# EAGLE board Lattepanda_shild_v1.3 (EAGLE 6.5.0)
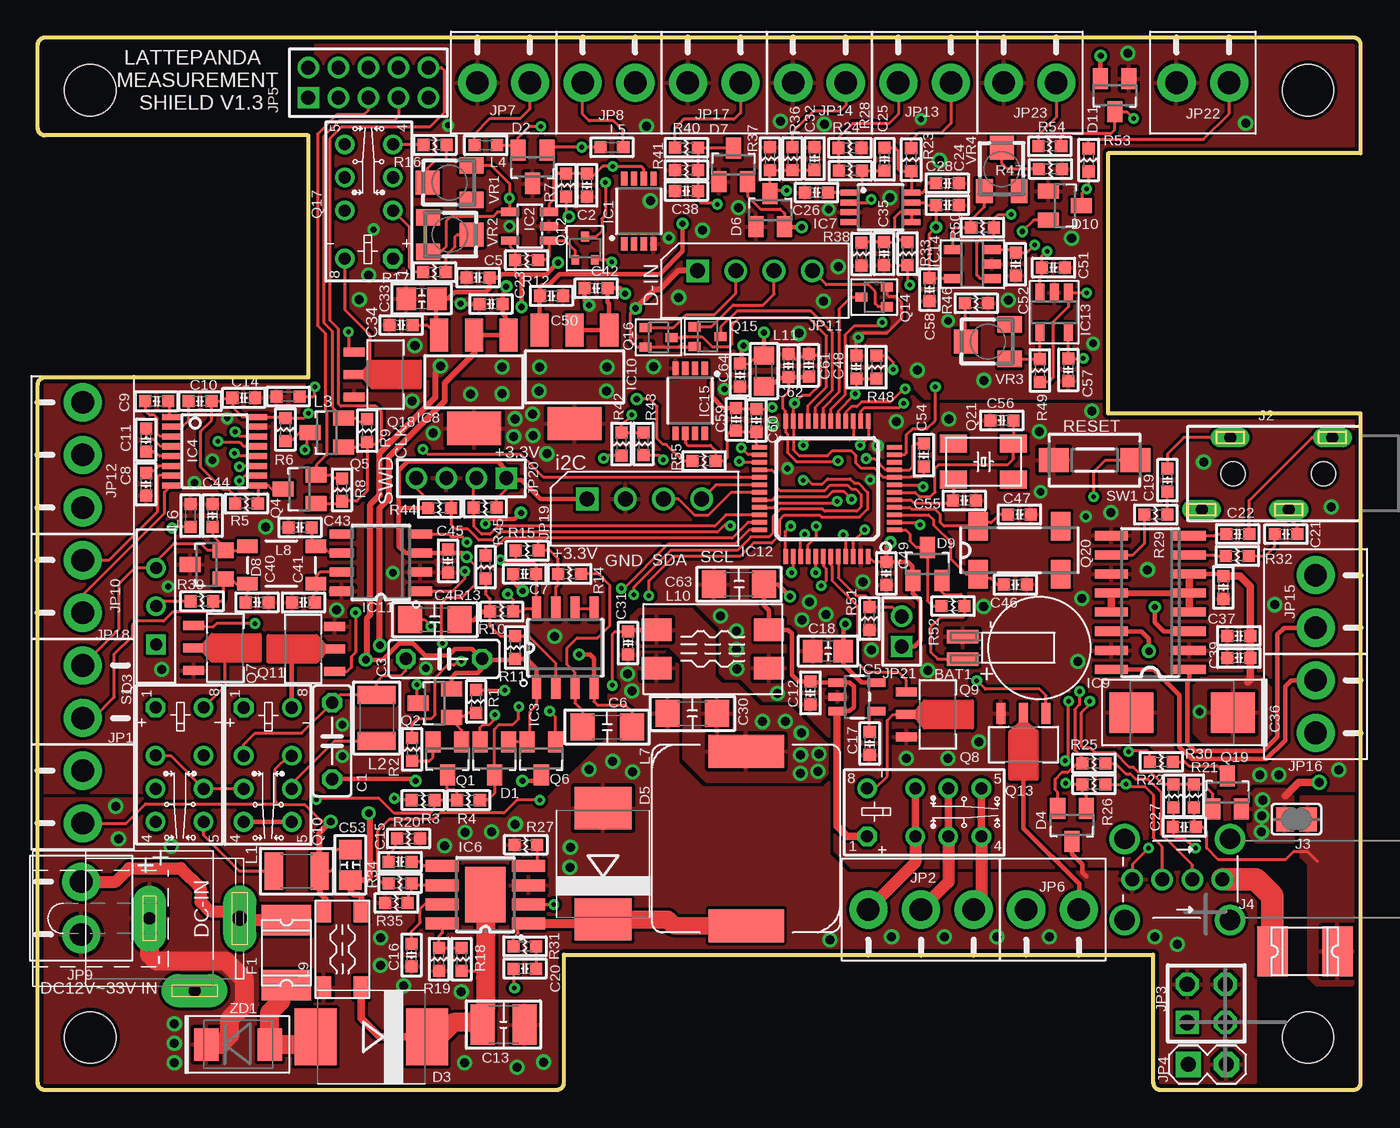
[diagram p2: board, top side]
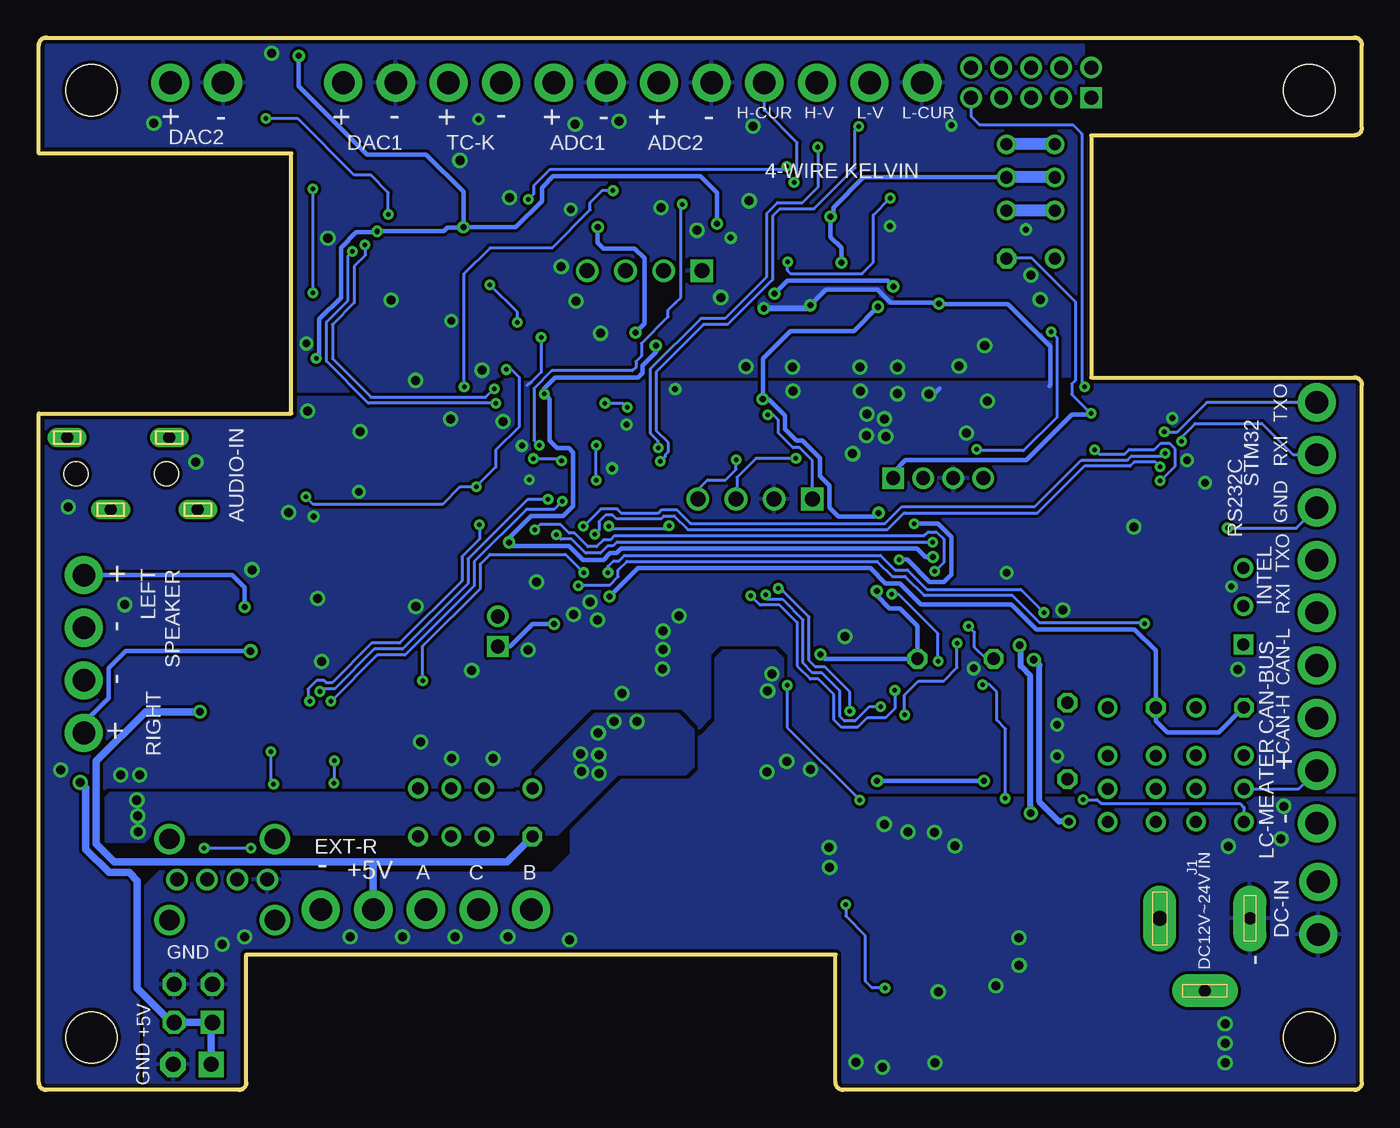
[diagram p3: board, bottom side, seen from below]

Size 88 x 70 mm. Coordinates in mm from the lower left corner, seen from the top.
Outline: 87.5,70 0.5,70 arc90 0,69.5 0,64 arc90 0.5,63.5 18,63.5 18,47.4 0.5,47.4 arc90 0,46.9 0,0.5 arc90 0.5,0 34.5,0 arc90 35,0.5 35,9 74.2,9 74.2,0.5 arc90 74.7,0 87.5,0 arc90 88,0.5 88,45 71.2,45 71.2,62.3 88,62.3 88,69.5 arc90 87.5,70
Copper layers (1*16): Top 0.035mm / dielectric 1.5mm / Bottom 0.035mm
Design rules "KHC_mm": minimum track width 0.2mm, minimum drill 0.3mm, track to track 0.2mm, track to pad 0.2mm, pad to pad 0.2mm, via to via 0.2mm, smd to smd 0.2mm, copper to edge 10mil, drill to drill 0.2mm, minimum pad ring 10mil, minimum via ring 8mil, stop-mask expansion 4mil, vias tented up to drill 0mil, thermal gap 10mil
Net classes: 0 default: width 0.178 mm, drill 0.3 mm, clearance 0.178 mm; 1 power: width 0.152 mm; 2 GND: width 0.152 mm, clearance 0.152 mm
Holes 3.4 mm at 3.5,66.5 84.5,66.5 3.5,3.5 84.5,3.5

## Footprints (pad centres in the part's own frame; a part is rotated, then mirrored left to right if it is on the bottom)
MS621 = smd 2.1 x 0.9: + 5.1,0.75; - 5.1,-0.75
C050-025X075 = drill 0.813 octagon: 1 -2.54,0; 2 2.54,0
C0603 = smd 0.8 x 0.8: 1 -0.762,0; 2 0.762,0
C3216 = smd 1.6 x 1.8: 1 -1.651,0; 2 1.651,0
C3225 = smd 1.6 x 2.7: 1 -1.397,0; 2 1.397,0
C2012 = smd 1.3 x 1.5: 1 -1.016,0; 2 1.016,0
C1608- = smd 0.8 x 0.8: 1 -0.762,0; 2 0.762,0
D/7343-31W = smd 2.95 x 2.7: + 3.375,0; - -3.375,0
SOT23 = smd 1 x 1.4: D 0,-1.1; G 0.95,1.1; S -0.95,1.1
SMC = smd 2.8 x 3.8: A 3.7,0; C -3.7,0
1812L = smd 2.03 x 3.3: P$1 -2.16,0; P$2 2.16,0
MS8 = smd 0.42 x 0.899: 1 -0.975,-2.166; 2 -0.325,-2.166; 3 0.325,-2.166; 4 0.975,-2.166; 5 0.975,2.166; 6 0.325,2.166; 7 -0.325,2.166; 8 -0.975,2.166
SOT23-5L = smd 0.55 x 1.2: 1 -0.95,-1.3; 2 0,-1.3; 3 0.95,-1.3; 4 0.95,1.3; 5 -0.95,1.3
SO8 = smd 0.6 x 1.6: 1 -1.905,-2.6; 2 -0.635,-2.6; 3 0.635,-2.6; 4 1.905,-2.6; 5 1.905,2.6; 6 0.635,2.6; 7 -0.635,2.6; 8 -1.905,2.6
PW_R-PDSO-G16 = smd 0.4 x 1.2: 1 -2.275,-2.9; 2 -1.625,-2.9; 3 -0.975,-2.9; 4 -0.325,-2.9; 5 0.325,-2.9; 6 0.975,-2.9; 7 1.625,-2.9; 8 2.275,-2.9; 9 2.275,2.9; 10 1.625,2.9; 11 0.975,2.9; 12 0.325,2.9; 13 -0.325,2.9; 14 -0.975,2.9; 15 -1.625,2.9; 16 -2.275,2.9
SOT23-5 = smd 0.55 x 1.2: 1 -0.95,-1.3; 2 0,-1.3; 3 0.95,-1.3; 4 0.95,1.3; 5 -0.95,1.3
S08-EP1 = smd 0.8 x 2.2: 1 -1.905,-2.87; 2 -0.635,-2.87; 3 0.635,-2.87; 4 1.905,-2.87; 5 1.905,2.87; 6 0.635,2.87; 7 -0.635,2.87; 8 -1.905,2.87 | smd 3.7 x 2.71: EX_PAD 0,0
MSOP8 = smd 0.4 x 1.2: 1 -0.975,-2.05; 2 -0.325,-2.05; 3 0.325,-2.05; 4 0.975,-2.05; 5 0.975,2.05; 6 0.325,2.05; 7 -0.325,2.05; 8 -0.975,2.05
SOT223-4 = smd 1.2 x 2.2: 1 -2.311,-3.1; 2 0,-3.1; 3 2.311,-3.1 | smd 3.6 x 2.2: 4 0,3.1
SOIC16N = smd 0.6 x 2.2: 1 -4.445,-2.6; 2 -3.175,-2.6; 3 -1.905,-2.6; 4 -0.635,-2.6; 5 0.635,-2.6; 6 1.905,-2.6; 7 3.175,-2.6; 8 4.445,-2.6; 9 4.445,2.6; 10 3.175,2.6; 11 1.905,2.6; 12 0.635,2.6; 13 -0.635,2.6; 14 -1.905,2.6; 15 -3.175,2.6; 16 -4.445,2.6
TQFP48 = smd 0.3 x 1: 1 -2.75,-4.5; 2 -2.25,-4.5; 3 -1.75,-4.5; 4 -1.25,-4.5; 5 -0.75,-4.5; 6 -0.25,-4.5; 7 0.25,-4.5; 8 0.75,-4.5; 9 1.25,-4.5; 10 1.75,-4.5; 11 2.25,-4.5; 12 2.75,-4.5; 25 2.75,4.5; 26 2.25,4.5; 27 1.75,4.5; 28 1.25,4.5; 29 0.75,4.5; 30 0.25,4.5; 31 -0.25,4.5; 32 -0.75,4.5; 33 -1.25,4.5; 34 -1.75,4.5; 35 -2.25,4.5; 36 -2.75,4.5 | smd 1 x 0.3: 13 4.5,-2.75; 14 4.5,-2.25; 15 4.5,-1.75; 16 4.5,-1.25; 17 4.5,-0.75; 18 4.5,-0.25; 19 4.5,0.25; 20 4.5,0.75; 21 4.5,1.25; 22 4.5,1.75; 23 4.5,2.25; 24 4.5,2.75; 37 -4.5,2.75; 38 -4.5,2.25; 39 -4.5,1.75; 40 -4.5,1.25; 41 -4.5,0.75; 42 -4.5,0.25; 43 -4.5,-0.25; 44 -4.5,-0.75; 45 -4.5,-1.25; 46 -4.5,-1.75; 47 -4.5,-2.25; 48 -4.5,-2.75
SOT23-5' = smd 0.6 x 1.2: 1 -0.95,-1.306; 2 0,-1.306; 3 0.95,-1.306; 4 0.95,1.306; 5 -0.95,1.306
SPC4077 = drill 0.8 pad 2.184 long: 1 -3,0; 2 0,-4.8 | drill 1 pad 2.184 long: 3 3,0
PJ-327-2 = drill 0.8 long: 1 -2.4,-1.9; 2 2.4,-4.8; 3 -2.4,-8.7; 4 2.4,-10.6 | hole 1.6: 0,-2.5; 0,-8.5
SJ = smd 1.168 x 1.6: 1 -0.762,0; 2 0.762,0
USB_AF_SIDE = drill 0.92: 1 3,0; 2 1,0; 3 -1,0; 4 -3,0 | drill 1.35: SH1 -3.5,2.7; SH2 3.5,2.7; SH3 -3.5,-2.7; SH4 3.5,-2.7
ED350V-02P = drill 1.5 pad 2.54: 1 -1.75,0; 2 1.75,0
ED350V-03P = drill 1.5 pad 2.54: 1 -3.5,0; 2 0,0; 3 3.5,0
2X02 = drill 1.016 square: 1 -1.27,-1.27 | drill 1.016 octagon: 2 -1.27,1.27; 3 1.27,-1.27; 4 1.27,1.27
MA02-1-MOL = drill 1 pad 1.676 square: 1 -1.27,0 | drill 1 pad 1.676 octagon: 2 1.27,0
2X05M = drill 0.914 square: 1 -4,-1 | drill 0.914: 2 -4,1; 3 -2,-1; 4 -2,1; 5 0,-1; 6 0,1; 7 2,-1; 8 2,1; 9 4,-1; 10 4,1
MOLEX5267-04 = drill 1 square: 1 -3.81,0 | drill 1: 2 -1.27,0; 3 1.27,0; 4 3.81,0
1X04M = drill 0.914 square: 1 -3,0 | drill 0.914: 2 -1,0; 3 1,0; 4 3,0
1X02M = drill 0.914 square: 1 -1,0 | drill 0.914: 2 1,0
L1210 = smd 1.2 x 2.5: 1 -1.524,0; 2 1.524,0
L0603 = smd 0.8 x 0.8: 1 -0.762,0; 2 0.762,0
SHP1260P-F = smd 2.2 x 5: 1 -5.8,0; 2 5.8,0
ACT45B = smd 1.35 x 0.9: 1 -2.275,1.25; 2 -2.275,-1.25; 3 2.275,-1.25; 4 2.275,1.25
SRF0602 = smd 1.5 x 1: 1 -2.55,1.25; 2 2.55,1.25; 3 2.55,-1.25; 4 -2.55,-1.25
SRF0905 = smd 2 x 1.5: 1 -3.75,1.27; 2 3.75,1.27; 3 3.75,-1.27; 4 -3.75,-1.27
L0805 = smd 1.2 x 1.3: 1 -1.016,0; 2 1.016,0
ANG200X = drill 0.8 octagon: 1 -4.3,-1.6 | drill 0.8: 2 -1.1,-1.6; 3 1.1,-1.6; 4 3.3,-1.6; 5 3.3,1.6; 6 1.1,1.6; 7 -1.1,1.6; 8 -4.3,1.6
MPT3 = smd 0.6 x 1.4: BASE -1.5,-2; EMITTER 1.5,-2 | smd 0.6 x 1.3: COLLECTOR 0,-2.05
SOT323 = smd 0.5 x 0.65: 1 0.65,-0.775; 2 -0.65,-0.775; 3 0,0.775
SC59-BEC = smd 0.6 x 0.8: 1 0.65,-0.863; 2 -0.65,-0.863; 3 0,0.863
MC-306 = smd 1.3 x 1.9: 1 -2.75,-1.6; 2 2.75,-1.6; 3 2.75,1.6; 4 -2.75,1.6
SMD5032 = smd 1.8 x 1.2: 1 -2,-1.2; 2 2,-1.2; 3 2,1.2; 4 -2,1.2
R0603 = smd 0.8 x 0.8: 1 -0.762,0; 2 0.762,0
R0603@1 = smd 0.8 x 0.8: 1 -0.762,0; 2 0.762,0
255SB = drill 0.8 square: 1 -2.54,0 | drill 0.8: 2 0,0; 3 2.54,0
DTSM-3 = smd 2 x 1.6: 1 -2.7,0; 2 2.7,0
R-TRIMMER-3313J = smd 1.1 x 1.6: 1 -1.15,-1.45; 3 1.15,-1.45 | smd 1.6 x 1.6: 2 0,1.45
SMB = smd 1.62 x 2.18: A 2.11,0; C -2.11,0

## Placement (x,y rotation side)
BAT1  MS621  [MS621]  66.63,29.41 180 top
C1  1000pF/1%  [C050-025X075]  19.59,23.22 270 top
C2  0.1uF  [C0603]  36.54,60.18 90 top
C3  1000pF  [C050-025X075]  27.03,28.68 0 top
C4  10uF/16V  [C3216]  26.42,31.29 180 top
C5  0.1uF  [C0603]  29.29,54.04 180 top
C6  10uF/16V  [C3216]  37.88,24.14 0 top
C7  0.1uF  [C0603]  32.39,34.33 180 top
C8  0.1uF  [C0603]  7.21,40.29 90 top
C9  0.1uF  [C0603]  7.92,45.81 0 top
C10  0.1uF  [C0603]  10.81,45.82 180 top
C11  0.1uF  [C0603]  7.21,43.23 90 top
C12  1uF/10V  [C0603]  51.4,26.41 90 top
C13  10uF/35V  [C3225]  30.99,4.35 0 top
C14  0.1uF  [C0603]  13.72,46.04 180 top
C15  2.2nF/50V  [C0603]  24.11,15.18 180 top
C16  0.1uF/50V  [C0603]  24.87,8.98 270 top
C17  470pF  [C0603]  55.34,23.05 90 top
C18  4.7uF  [C2012]  52.57,29.2 180 top
C19  0.22uF  [C0603]  75.14,40.57 90 top
C20  10nF/50V  [C0603]  32.41,8.07 180 top
C21  0.22uF  [C0603]  83.03,36.97 0 top
C22  1uF  [C0603]  79.82,36.98 0 top
C23  0.1uF/50V  [C1608-]  30.15,52.28 0 top
C24  1nF  [C0603]  60.5,60.31 0 top
C25  10nF  [C0603]  56.33,61.9 270 top
C26  1nF  [C0603]  51.81,59.69 180 top
C27  0.1uF  [C0603]  76.26,17.49 180 top
C28  0.1uF  [C0603]  60.51,58.86 0 top
C29  1uF  [C0603]  78.86,33.43 270 top
C30  22uF/10V  [C3216]  43.55,25.04 180 top
C31  0.1uF  [C0603]  39.27,29.73 270 top
C32  10nF  [C0603]  51.68,61.96 90 top
C33  4.7uF  [C2012]  25.54,52.63 180 top
C34  10nF  [C1608-]  24.18,50.88 0 top
C35  1uF  [C0603]  56.29,55.62 270 top
C36  470uF  [D/7343-31W]  76.12,25.11 0 top
C37  1uF  [C0603]  79.89,30.2 0 top
C38  10nF  [C0603]  43.15,59.79 180 top
C39  0.1uF  [C0603]  79.89,28.74 0 top
C40  47pF  [C0603]  14.59,32.44 0 top
C41  47pF  [C0603]  17.68,32.43 180 top
C42  0.1uF/50V  [C0603]  37.15,53.33 180 top
C43  47pF  [C0603]  17.45,37.42 180 top
C44  47pF  [C0603]  11.64,38.21 270 top
C45  0.1uF  [C0603]  27.29,35.19 90 top
C46  12.5pF  [C0603]  65.03,33.61 180 top
C47  12.5pF  [C0603]  65.3,38.28 180 top
C48  0.1uF  [C0603]  54.45,48.09 90 top
C49  1uF  [C0603]  56.45,34.36 270 top
C50  1uF/16V  [C0603]  34.18,52.82 180 top
C51  10nF  [C0603]  67.56,54.7 180 top
C52  10nF  [C0603]  65.06,54.93 90 top
C53  4.7uF  [C2012]  20.79,14.97 90 top
C54  1uF  [C0603]  58.94,42.23 90 top
C55  18pF  [C0603]  61.63,39.21 180 top
C56  18pF  [C0603]  64.13,44.54 0 top
C57  100nF  [C0603]  68.55,47.9 90 top
C58  100nF  [C0603]  59.32,53.24 90 top
C59  1uF  [C0603]  46.46,44.61 90 top
C60  10nF  [C0603]  47.8,44.54 270 top
C61  1uF  [C0603]  51.29,48.2 270 top
C62  10nF  [C0603]  49.93,48.18 270 top
C63  22uF/10V  [C3216]  46.65,33.64 180 top
C64  1uF  [C0603]  46.72,47.54 90 top
D1  BAV99  [SOT23]  30.38,22.05 0 top
D2  NUP2105  [SOT23]  32.92,61.4 0 top
D3  MBRS540T3  [SMC]  22.2,3.53 180 top
D4  NUP2105  [SOT23]  68.79,17.63 0 top
D5  MBRS540T3  [SMC]  37.61,15.05 90 top
D6  BAV99  [SOT23]  48.72,58.53 180 top
D7  BAV99  [SOT23]  46.27,61.53 180 top
D8  NUP2105  [SOT23]  11.24,34.95 270 top
D9  BAT54C  [SOT23]  59.18,34.98 180 top
D10  BAV99  [SOT23]  68.31,58.82 90 top
D11  BAV99  [SOT23]  71.64,66.16 0 top
F1  1812L110/33  [1812L]  16.55,9.13 90 top
F2  FSMD300R  [1812L]  84.28,9.22 0 top
IC1  LT1634ACS-1.25  [MS8]  39.99,58.45 0 top
IC2  LT6202  [SOT23-5L]  32.73,57.45 90 top
IC3  LM311  [SO8]  35.1,29.41 0 top
IC4  MAX3232CPW  [PW_R-PDSO-G16]  11.78,42.49 270 top
IC5  MIC5219-3.3V  [SOT23-5]  54.5,26.15 270 top
IC6  AOZ1284PI  [S08-EP1]  29.78,12.99 90 top
IC7  AD8495  [MSOP8]  56.06,58.71 270 top
IC8  TLE4266  [SOT223-4]  29.02,47.11 180 top
IC9  PAM8403  [SOIC16N]  74,32.42 90 top
IC10  TLE4266GSV10  [SOT223-4]  35.71,47.44 180 top
IC11  SN65HVD230  [SO8]  22.83,35.08 90 top
IC12  STM32F373X  [TQFP48]  52.5,40 90 top
IC13  LT1783  [SOT23-5']  67.61,51.73 180 top
IC14  LT1783  [SOT23-5']  62.17,54.93 90 top
IC15  LT1634ACS-2.5  [MS8]  43.4,45.85 180 top
J1  DC_POWER  [SPC4077]  10.44,11.41 0 top
J2  PJ-327  [PJ-327-2]  88.02,41 270 top
J3  B0  [SJ]  83.72,18.01 180 top
J4  USB A/F  [USB_AF_SIDE]  75.8,14 0 top
JP1  LC  [ED350V-02P]  3,19.49 270 top
JP2  RELAY1  [ED350V-03P]  58.75,12 0 top
JP3  Latte_5V  [2X02]  77.72,5.77 0 top
JP4  FAN  [MA02-1-MOL]  77.8,1.7 0 top
JP5  Latte_Intel  [2X05M]  22,67 0 top
JP6  LOW_SIDE_OUT  [ED350V-02P]  67.5,12 0 top
JP7  4WIR1  [ED350V-02P]  31,67 180 top
JP8  4WIR1  [ED350V-02P]  38,67 180 top
JP9  DC-IN  [ED350V-02P]  2.9,12.1 270 top
JP10  RS232C_LA  [ED350V-02P]  3,33.49 270 top
JP11  DI  [MOLEX5267-04]  47.71,54.49 0 top
JP12  RS232C_MCU  [ED350V-03P]  3,42.24 270 top
JP13  TC1  [ED350V-02P]  59,67 180 top
JP14  ADC1/COP1  [ED350V-02P]  52,67 180 top
JP15  L-SPEAKER  [ED350V-02P]  85,32.5 90 top
JP16  R-SPEAKER  [ED350V-02P]  85,25.5 90 top
JP17  ADC2/COP2  [ED350V-02P]  45,67 180 top
JP18  CAN-BUS  [ED350V-02P]  3,26.49 90 top
JP19  i2C  [MOLEX5267-04]  40.36,39.31 0 top
JP20  SWD  [1X04M]  28.18,40.7 180 top
JP21  BOOT  [1X02M]  57.46,30.5 90 top
JP22  DAC1  [ED350V-02P]  77.5,67 180 top
JP23  DAC1  [ED350V-02P]  66,67 180 top
L1  100uH/1812R-104F  [L1210]  17.24,14.55 0 top
L2  100uH/1812R-104F  [L1210]  22.55,24.74 90 top
L3  BEAD  [L0603]  16.67,46.13 180 top
L4  BEAD  [L0603]  29.81,62.84 180 top
L5  BEAD  [L0603]  38.19,62.7 0 top
L6  BEAD  [L0603]  10.17,38.21 90 top
L7  22uH  [SHP1260P-F]  47.12,16.73 270 top
L8  ACT45B-510-2P-TL003  [ACT45B]  16.23,34.92 180 top
L9  SRF0602-100Y  [SRF0602]  20.28,9.36 90 top
L10  SRF0905-100Y  [SRF0905]  44.9,29.34 0 top
L11  10uH  [L0805]  48.31,47.82 270 top
Q1  Si2333DS  [SOT23]  27.26,22.05 0 top
Q2  BSS138SOT23  [SOT23]  26.42,25.73 270 top
Q3  AGN2004  [ANG200X]  9.44,21.14 270 top
Q4  BSS138SOT23  [SOT23]  17.44,39.97 270 top
Q5  BSS138SOT23  [SOT23]  19.24,43.73 270 top
Q6  2N7002  [SOT23]  33.5,22.05 0 top
Q7  DTDG23YP  [MPT3]  12.39,29.41 270 top
Q8  AGN2004  [ANG200X]  59.47,18.46 0 top
Q9  DTDG23YP  [MPT3]  59.77,24.98 270 top
Q10  AGN2004  [ANG200X]  15.31,21.13 270 top
Q11  DTDG23YP  [MPT3]  17.75,29.34 90 top
Q12  2SB1694  [SOT323]  36.41,55.99 0 top
Q13  DTDG23YP  [MPT3]  65.57,23.06 180 top
Q14  DTC114EUA  [SC59-BEC]  55.64,52.74 90 top
Q15  DTC114EUA  [SC59-BEC]  44.55,50.11 270 top
Q16  DTC114EUA  [SC59-BEC]  41.3,50.06 270 top
Q17  AGN2003  [ANG200X]  22.03,59.6 90 top
Q18  DTDG23YP  [MPT3]  23.04,47.59 270 top
Q19  Si2333DS  [SOT23]  79.12,19.79 180 top
Q20  32.768k  [MC-306]  65.3,35.9 0 top
Q21  8MHz  [SMD5032]  62.91,41.79 0 top
R1  1k  [R0603]  29.17,25.84 270 top
R2  1k  [R0603]  24.9,22.66 90 top
R3  1kF  [R0603]  25.65,19.28 0 top
R4  10k  [R0603]  28.65,19.28 0 top
R5  10kF  [R0603]  13.89,39.01 180 top
R6  10kF  [R0603]  16.48,43.93 90 top
R7  18k  [R0603]  35.14,60.18 90 top
R8  10kF  [R0603]  20.25,39.92 270 top
R9  10kF  [R0603]  21.91,43.86 270 top
R10  100k  [R0603]  30.87,31.82 0 top
R11  100k  [R0603]  31.77,29.43 90 top
R12  100kF  [R0603]  32.53,55.2 180 top
R13  100k  [R0603]  29.79,34.78 90 top
R14  47k  [R0603]  35.38,34.32 180 top
R15  1k  [R0603]  32.56,35.87 180 top
R16  360  [R0603]  26.43,62.86 180 top
R17  3.6k  [R0603]  26.39,54.4 180 top
R18  47k  [R0603]  28.19,8.7 270 top
R19  11k  [R0603]  26.69,8.7 90 top
R20  10kF  [R0603]  24.66,16.73 180 top
R21  10k  [R0603]  76.9,19.57 270 top
R22  10k  [R0603]  75.55,19.56 90 top
R23  10kF  [R0603]  58.1,61.88 270 top
R24  1M  [R0603]  54.03,62.66 180 top
R25  27  [R0603]  70.26,21.73 0 top
R26  27  [R0603]  70.26,20.34 0 top
R27  46.6k  [R0603]  32.47,16.31 180 top
R28  10kF  [R0603]  54.05,61.14 0 top
R29  1k  [R0603]  74.36,38.28 180 top
R30  1.5k  [R0603]  74.75,21.83 0 top
R31  0  [R0603]  32.41,9.56 180 top
R32  1k  [R0603]  79.79,35.52 180 top
R33  30kF  [R0603]  57.86,55.63 270 top
R34  52.3kF  [R0603]  24.11,13.75 180 top
R35  10kF  [R0603]  23.86,12.45 0 top
R36  115kF  [R0603]  50.2,61.95 270 top
R37  10kF  [R0603]  48.71,61.94 270 top
R38  10kF  [R0603]  54.8,55.6 90 top
R39  120  [R0603@1]  10.93,32.51 180 top
R40  115kF  [R0603]  43.15,62.67 0 top
R41  10kF  [R0603]  43.15,61.18 0 top
R42  2.2k  [R0603]  38.83,42.97 270 top
R43  2.2k  [R0603]  40.29,42.98 270 top
R44  10k  [R0603]  26.73,38.72 180 top
R45  10k  [R0603]  29.77,38.74 0 top
R46  53kF  [R0603]  62.43,52.33 180 top
R47  53kF  [R0603]  67.37,61.26 180 top
R48  10k  [R0603]  55.79,48.08 270 top
R49  30kF  [R0603]  66.66,47.86 270 top
R50  30kF  [R0603]  62.85,57.36 0 top
R51  10k  [R0603]  55.33,31.36 90 top
R52  11k  [R0603]  60.88,32.19 0 top
R53  100  [R0603]  69.9,61.86 90 top
R54  100  [R0603]  67.31,62.77 180 top
R55  18k  [R0603]  44.33,41.84 0 top
S1  CAN_TERMI  [255SB]  7.88,32.18 90 top
SW1  RESET\  [DTSM-3]  70.3,41.89 180 top
VR1  50  [R-TRIMMER-3313J]  27.4,60.35 90 top
VR2  500  [R-TRIMMER-3313J]  27.42,56.9 270 top
VR3  10k  [R-TRIMMER-3313J]  63.2,49.78 90 top
VR4  10k  [R-TRIMMER-3313J]  64.12,61.24 0 top
ZD1  SM6T39CAY  [SMB]  13.33,3.03 0 top

## Tracks (layer width: path | path; a pad name or v marks a point on that pad's centre or on a via)
+1.25V_REF  (via drill 0.3)
  Top 0.2: IC2.3 34.03,58.91 34.33,59.21 34.33,60.77 34.5,60.94 R7.2 C2.2 36.61,60.87 36.61,60.84 36.99,60.84 37.59,61.44 v38.27,61.44 40.16,61.44 40.31,61.28 IC1.6 | IC7.2 55.23,59.03 v55.43,59.24
  Bottom 0.2: v55.43,59.24 55.08,59.59 55.08,60.14 53.98,61.23 38.47,61.23 v38.27,61.44
+3V3  (via drill 0.3, 0.4)
  Top 0.2: 27.29,35.72 C45.2 | 57.82,34.26 D9.G | IC12.17 53.25,45.15 54.31,46.21 v54.38,46.29 54.45,46.46 C48.1 R48.2 | C64.2 47.3,48.29 47.59,48.58 48.05,48.58 L11.1 48.42,48.99 | D7.S 47.22,59.45 48.08,58.59 49.39,58.59 49.67,58.31 D6.S | 55.5,35.25 IC12.48 55.63,35.12 C49.1 | R43.1 40.39,43.73 R42.1 38.85,43.75 38.85,44.22 v39.53,44.9 | R45.2 30.53,39.3 31.17,39.94 JP20.1 | R5.2 13.13,39.54 12.72,39.95 12.33,39.95 10.86,41.42 10.86,43.82 11.57,44.53 C10.1 12.22,45.82 12.4,46 12.92,46 C14.2 12.96,45.43 13.62,44.77 IC4.16 16.41,44.77 R6.2 17.71,44.69 v18.02,45 | v28.53,35.45 29.07,34.91 29.07,33.59 28.21,32.73 27.2,32.73 26.84,32.37 26.84,29.79 v26.92,29.71 | D1.S 29.43,24.13 29.63,24.33 30.07,24.33 30.42,24.68 v30.42,24.95
  Top 0.3: D6.S 49.71,57.39 v50.82,57.39 | v46.96,49.51 v46.96,49.5 46.8,49.34 46.8,48.32 C64.2 | 56.5,36.2 v56.73,36.43 56.45,36.15 C49.1 57.88,35.12 58.18,34.82 58.18,33.93 D9.G 58.23,33.01 58.72,32.52 58.72,29.91 58.3,29.49 JP21.1 | JP19.1 33.45,39.31 32.19,40.57 31.31,40.57 JP20.1 31.17,41.23 30.61,41.79 24.6,41.79 24.01,41.2 24.01,38.5 | 24.01,38.5 24.01,36.16 24.46,35.71 IC11.3 27.29,35.72 28.27,35.72 v28.53,35.45 | L11.1 v48.31,50.37 v48.32,50.38 | R44.2 24.23,38.72 24.01,38.5 | IC5.5 54.78,27.1 53.59,28.29 C18.1 | C18.1 | C18.1 53.59,30.86 v53.72,30.99
  Bottom 0.2: JP19.1 36.55,41.88 37.4,42.73 37.83,42.73 R42.1 38.83,44.59 39.14,44.9 v39.53,44.9 | Q17.1 23.61,55.32 21.94,55.32 19.06,52.44 19.06,47.19 19.29,46.96 19.29,46.27 v18.02,45 | v30.42,24.95 30.42,26.27 29.49,27.2 27.81,27.2 26.92,28.09 v26.92,29.71
  Bottom 0.3: v46.96,49.51 46.96,49.08 47.84,48.2 47.84,47.7 48.16,47.38 53.67,47.38 54.38,46.67 v54.38,46.29 54.04,45.95 54.04,43.19 53.54,42.69 52.73,42.69 52.45,42.41 52.45,38.85 53.13,38.17 55.27,38.17 56.73,36.71 v56.73,36.43 56.48,36.18 52.73,36.18 51.81,35.26 50.45,35.26 50,35.71 49.57,35.71 49.27,36.01 29.59,36.01 29.04,35.46 v28.54,35.46 v28.53,35.45 | v18.02,45 18.09,44.93 19.29,44.93 22.33,41.89 30.36,41.89 31.17,41.08 JP20.1 | JP21.1 56.64,29.51 55.16,30.99 v53.72,30.99 | v48.32,50.38 47.72,50.98 47.72,55.32 48.37,55.97 50.44,55.97 50.82,56.35 v50.82,57.39
+5V  (via drill 0.3, 0.6)
  Top 0.2: v33.39,19.29 31.89,19.29 31.02,18.42 26.76,18.42 26.33,17.99 23.39,17.99 22.63,17.23 22.63,14.05 22.93,13.75 R34.2 | 38.98,30.5 C31.1 39.16,30.49 38.39,30.49 38.23,30.33 v38.23,26.91
  Top 0.3: L10.1 39.09,30.61 C31.1
  Top 0.5: v85.25,20.46 83.87,20.46 82.97,19.56
  Bottom 0.2: v33.39,19.29 38.23,24.13 v38.23,26.91
  Bottom 0.5: JP4.1 76.53,4.42 JP3.1 JP3.3 79.19,4.5 81.45,6.76 81.45,13.91 82,14.46 83.32,14.46 84.88,16.02 84.88,20.09 v85.25,20.46
  other vias: 81.4,17.16 81.47,19.28 81.42,18.22 50.79,23.76 50.75,22.28 50.74,21.07 49.73,24.52 51.97,22.36 51.91,21.2 48.2,24.5
  pour Top: 83,20 81,20 80.5,19.5 80.5,17 81,16.5 83.5,16.5 83.5,19.5
  pour Bottom: 83.5,19.5 83.25,19.75 56.25,19.75 51,25 45.5,25 44.5,24 44.5,21.5 45,21 49.5,21 53.5,17 80.5,17 81,16.5 83.5,16.5
  pour Top: 40,32 43.5,32 45,30.5 45,27.5 45.5,27 46.5,27 48,25.5 50,25.5 52.5,23 52.5,21 52,20.5 44.5,20.5 43,22 43,28.5 42,29.5 40,29.5 39.5,30 39.5,31.5
+5V/1  (via drill 0.3, 0.4)
  Top 0.2: R7.1 35.14,58.28 v35.33,58.09 | IC2.5 31.43,56.1 31.77,55.76 R12.2 31.77,54.26 31.79,54.24 | C34.2 25.86,50.88 IC8.3 | 31.96,35.12 32.99,35.12 33.15,34.96 C7.1 33.2,34.29 IC3.8 32.39,32.01 32.2,31.82 R10.2 31.63,32.62 v31.26,32.99 | 31.96,35.12 30.93,35.12 v30.78,35.27 | R15.2 31.8,35.28 31.96,35.12 | R55.1 42.91,41.84 41.8,42.94 41.59,42.94 41.21,43.32 41.21,45.47 40.72,45.96 v39.86,45.96 v39.85,45.95 | R2.2 24.9,24.38 25.23,24.71 26.19,24.71 26.44,24.96 26.44,27.42 27.28,28.26 27.7,28.26 27.96,28.52 v28.19,28.52
  Top 0.3: 31.79,54.24 32.16,54.24 | 32.16,54.24 33.83,54.24 v34.62,55.03 | IC8.3 26.49,50.48 26.49,52.56 C33.1 27.31,52.63 27.75,53.07 29.81,53.07 30.05,53.31 C5.1 30.66,54.04 30.88,54.26 31.77,54.26 | v32.19,52.09 32.19,54.21 32.16,54.24 | v29.77,37.67 30.04,37.97 31.72,37.97 v32.14,38.39
  Bottom 0.2: v31.26,32.99 30.83,32.99 28.19,30.35 v28.19,28.52
  Bottom 0.3: v32.19,52.09 33.79,50.49 38.02,50.49 39.85,48.66 v39.85,45.95 39.46,45.95 38.38,44.87 38.38,43.95 37.62,43.19 37.2,43.19 36.05,42.04 36.05,40.84 35.41,40.2 35.41,38.73 34.81,38.13 32.4,38.13 v32.14,38.39 | v34.62,55.03 34.62,56.03 35.33,56.74 v35.33,58.09 35.14,58.28 35.14,58.7 33.14,60.7 Q17.3 | v29.77,37.67 28.19,37.67 27.3,36.78 27.3,34.29 27.8,33.79 28.75,33.79 30.23,35.27 v30.78,35.27
  Bottom 0.8: Q17.6 Q17.3
+5V/3  (via drill 0.4, 0.5)
  Top 0.2: 78.85,34.08 C29.1
  Top 0.3: IC9.6 78.73,34.33 C29.1 | IC5.3 54.01,25.2 54.28,25.47 54.28,26.83 54.01,27.1 IC5.1 51.47,27.1 C12.2 50.59,27.17 50.16,27.6 50.16,30.36 49.91,30.61 L10.2 48.65,31.89 48.31,32.23 C63.1 | C63.1 | C63.1 49.23,33.63 v50.03,32.83
  Top 0.4: IC9.12 IC9.5
  Top 0.5: 80.49,27.14 80.65,27.3 C39.2 C37.2 80.65,33.48 79.94,34.19 C29.1 | IC9.4 IC9.5 IC9.6 | IC9.13 IC9.12 | Q8.1 53.85,16.86 53.15,17.56 53.15,25.15 IC5.3
  Bottom 0.3: Q3.1 7.88,25.44 9.53,23.79 12.94,23.79 13.71,24.56 Q10.1 13.71,29.23 15.12,30.64 21.64,30.64 23.31,32.31 29.33,32.31 30.72,33.7 31.69,33.7 32.7,34.71 48.15,34.71 v50.03,32.83
  Bottom 0.5: v77.27,25.16 80.89,25.16 84.17,21.88 84.17,16.37 83.09,15.29 83.08,15.29 82.98,15.19 66,15.19 | 66,15.19 56.84,15.19 Q8.1 | 66,15.19 65.91,15.09 65.75,14.94 JP6.1
  pour Top: 77.5,27.5 81.29,27.5 81.99,26.8 81.99,23.64 81.31,22.96 77.69,22.96 76.89,23.76 76.89,26.89
+10V  (via drill 0.3, 0.34, 0.4)
  Top 0.2: IC7.7 58.98,59.03 59.16,58.86 C28.1 | 59.73,58.84 59.73,57.42 v59.76,57.39 59.32,56.95 C58.2 59.25,53.98 IC14.5 | IC13.5 C57.2 v69.55,48.66 | D10.S 66.26,57.87 v65.5,57.11
  Top 0.3: 59.73,58.84 C28.1 | D11.S v70.69,68.77 v70.7,68.78 | 33.26,52.64 C50.2 | 33.38,52.78 C50.2 | IC10.3 33.4,52.8 C50.2 | C50.2 33.41,53.4 33.55,53.54 33.98,53.54 34.72,54.28 41.38,54.28 42.9,55.8 v42.9,57.63
  Bottom 0.2: 59.78,57.37 v59.76,57.39 | 65.55,57.06 v65.5,57.11
  Bottom 0.3: v70.7,68.78 70.7,66.75 66.17,62.22 62.23,62.22 59.75,59.74 v59.75,57.4 v59.76,57.39 56.28,57.39 54.54,59.13 54.54,60.01 53.78,60.77 43.98,60.77 42.9,59.69 v42.9,57.63 | 59.78,57.37 60.83,57.37 61.09,57.11 v65.5,57.11 | 65.55,57.06 66.88,57.06 67.9,56.04 67.9,52.71 69.34,51.27 69.34,48.87 v69.55,48.66
+UB
  Top 0.2: 85.12,15.21 84.45,15.88 83.55,15.88 82.99,15.32 78.52,15.32 77.75,16.09 77.75,17.21 77.47,17.49 C27.1 76.9,17.41 R21.2
  pour Top (rank 3): 84,19.5 84,15.5 84.5,15 84.5,7.5 85,7 87.5,7 87.5,19.5
AGND  (via drill 0.3, 0.4, 0.5, 0.6)
  Top 0.2: 46.52,45.39 C59.2 46.53,45.3 C60.1 48.76,45.3 v48.86,45.4 v48.85,45.39 | C54.1 58.94,40.92 58.81,40.79 58.08,40.79 58.06,40.77 58.05,40.77 58.03,40.75 IC12.8 56.27,40.75 55.68,41.34 54.79,41.34 54.43,41.7 54.43,42.2 54.11,42.52 52.86,42.52 52.54,42.2 50.64,42.2 50.26,42.58 IC12.23 50.25,45.48 50.34,45.57 v50.34,45.69 50.87,46.22 51.35,46.22 52.06,46.93 52.06,48.74 51.95,48.85 51.4,48.85 C61.1 51.28,48.79 50.72,48.79 50.5,48.57 C62.1 | JP1.2 5.88,17.74 7.18,19.04 15.98,19.04 | C53.2 19.98,16.01 19.7,15.73 19.7,14.74 19.51,14.55 L1.2 | v19.49,17.86 18.89,17.86 17.8,18.95 16.07,18.95 15.98,19.04 | D1.G Q6.S 32.73,23.26 32.73,25.14 33.2,25.61 IC3.1 | 29.64,28.61 C3.2 | Q10.7 16.69,22.23 15.77,21.31 15.77,19.25 15.98,19.04 | IC3.4 37.01,25.84 37.23,25.61 39.08,25.61 39.52,25.17 C6.2
  Top 0.3: C59.2 45.6,45.37 44.85,46.13 44.85,47.11 | C3.2 | v21.82,28.63 21.85,28.6 22.95,28.6 24.04,29.69 24.97,29.69 25.76,28.9 27.34,28.9 27.78,29.34 28.91,29.34 C3.2 | C7.2 31.63,33.83 v32.27,33.19 | 29.64,28.61 31.71,28.61 R11.1 32.53,28.67 33.2,28 IC3.1 | IC3.4 37.01,28.7 36.75,28.96 v36,28.96 | Q2.S 27.52,27.41 27.84,27.73 29.26,27.73 29.57,28.04 C3.2
  Top 0.4: L9.2 19.17,12.69 18.78,13.08 18.78,14.53 L1.2 | 18.78,14.57 L1.2 | L1.2 18.76,17.13 v19.49,17.86 | v26.79,48.16 26.47,47.68 26.47,46.08 22.75,42.36 22.75,39.56 22.13,38.94 22.13,31.6 21.89,31.36 21.89,28.7 v21.82,28.63
  Bottom 0.2: 48.88,45.4 v48.86,45.4 49.15,45.69 v50.34,45.69
  Bottom 0.3: v36,28.96 35.72,28.68 C3.2 29.57,30.88 30.73,32.04 31.42,32.04 32.27,32.89 v32.27,33.19
  Bottom 0.4: v19.49,17.86 20.14,17.86 21.45,19.17 21.45,28.26 v21.82,28.63
  other vias: 33.38,48.09 30.88,48.09 37.88,48.09 56.68,59.35 53.25,54.77 59.99,61.83 68.77,56.66 60.55,51.17 64.56,52.53 72.52,68.95 52.61,58.58 46.62,58.69 42.64,52.72 22.02,54.2 31.39,57.47 22.35,57.24 27.31,64.16 40.51,64.11 49.4,64.43 58.75,64.58 52.32,64.23 58.51,47.87 62.94,47.2 80.34,64.3 44.22,57.18 25.09,49.51 40.96,48.12 21.4,52.56 41.98,56.68 40.75,59.14 52.27,52.48 50.64,50.33 70.2,49.65
  pour Top (rank 2): 18.5,70 88,70 88,62.5 71,62.5 71,46 59,46 57.5,47.5 18.5,47.5
  pour Bottom (rank 2): 18.5,70 88,70 88,62.5 71,62.5 71,46.5 58.5,46.5 57.5,47.5 18.5,47.5
BOOT1
  Top 0.2: IC12.44 53.25,34.07 54.45,32.87 55.07,32.87 55.35,32.59 R51.2 56.84,32.12 JP21.2
C_ADC  (via drill 0.3)
  Top 0.2: R4.2 29.93,19.28 30.38,19.73 D1.D 30.38,23.99 30.69,24.3 31.61,24.3 32,24.69 v32,25.49 | IC12.28 48.83,41.25 49.13,40.95 49.13,40.12 49.37,39.88 52.35,39.88 52.7,40.23 53.86,40.23 54.13,39.96 54.42,39.96 54.79,39.59 54.79,38.82 54.48,38.51 52.35,38.51 52.21,38.65 49.41,38.65 49.05,38.29 49.04,38.29 48.92,38.17 48.92,37.06 48.65,36.79 47.44,36.79 46.54,35.89 42.1,35.89 39.66,33.45 v39.66,32.93
  Bottom 0.2: v32,25.49 32.78,25.49 33.73,24.54 34.4,24.54 34.72,24.86 34.72,26.55 35.92,27.75 36.53,27.75 37.17,28.39 37.17,31.28 38.54,32.65 39.55,32.65 39.66,32.76 v39.66,32.93
C_CTL  (via drill 0.3)
  Top 0.2: IC12.15 54.25,43.49 54.02,43.26 51.31,43.26 v50.92,42.87 | v40.66,32.88 40.66,33.87 42.28,35.49 46.71,35.49 47.6,36.38 48.82,36.38 48.83,36.39 48.83,36.4 49.33,36.9 49.33,37.92 49.65,38.24 52.02,38.24 52.16,38.1 54.66,38.1 55.2,38.64 55.2,39.75 54.59,40.36 54.32,40.36 54.03,40.65 52.54,40.65 52.19,40.3 51.51,40.3 51.26,40.55 v50.92,40.55 | R1.1 31.04,26.6 v31.06,26.58
  Bottom 0.2: v40.66,32.88 40.03,32.25 38.72,32.25 37.57,31.1 37.57,28.22 36.69,27.34 36.16,27.34 35.12,26.3 35.12,24.63 34.61,24.12 33.55,24.12 33.52,24.15 33.51,24.15 32.88,24.78 31.66,24.78 31.06,25.38 v31.06,26.58 | v50.92,40.55 v50.92,42.87
CAN_RX  (via drill 0.3)
  Top 0.2: IC12.45 53.75,36.75 v53.57,36.93 | IC11.4 27.32,36.98 27.5,36.81 28.25,36.81 v28.54,36.44
  Bottom 0.2: v28.54,36.44 28.64,36.46 49.54,36.46 49.81,36.19 50.17,36.19 50.65,35.71 51.62,35.71 52.55,36.64 53.28,36.64 v53.57,36.93
CAN_TX  (via drill 0.3)
  Top 0.2: 25.52,33.08 IC11.1 27.59,33.17 28.41,33.99 v28.41,34.5 | IC12.46 54.25,36.5 v55.01,37.26
  Bottom 0.2: v28.41,34.5 27.81,35.1 27.81,36.64 28.3,37.13 28.84,37.13 29.1,36.87 49.7,36.87 49.98,36.59 50.44,36.59 50.89,36.14 51.48,36.14 52.38,37.04 52.73,37.04 53.3,37.61 54.66,37.61 v55.01,37.26
CANH
  Top 0.2: C40.1 13.79,32.24 13.79,32.79 13.98,32.98 L8.4 13.91,33.6 13.26,33.6 12.86,34 D8.G 12.34,32.63 12.22,32.51 R39.1 11.69,31.94 11.53,31.78 8.97,31.78 8.38,31.19 6.57,31.19 6.3,30.92 6.3,30.18 5.11,28.99 5.11,26.13 3.72,24.74 JP18.1
CANL
  Top 0.2: D8.S 13.84,35.9 L8.3 | JP18.2 5.4,30.64 5.4,33.67 6.45,34.72 S1.3 7.88,35.16 9.07,36.35 10.85,36.35 11.29,35.91 D8.S | D8.S 12.34,36.19 11.64,36.89 C44.2
COMP1_P  (via drill 0.3)
  Top 0.2: C32.1 51.67,61.19 R36.2 50.19,61.18 R37.2 48.72,61.17 D6.D 48.91,59.82 v49.81,59.82 | IC12.11 57.66,42.25 57.8,42.39 57.8,43.58 58.21,43.99 59.16,43.99 59.71,44.54 v59.71,46.77
  Bottom 0.2: v59.71,46.77 v59.7,46.78 59.7,54.3 58,56 53.86,56 51.32,58.54 51.32,59.03 50.53,59.82 v49.81,59.82
COMP2_P  (via drill 0.3)
  Top 0.2: D7.D 46.23,62.67 R40.2 R41.2 C38.1 43.91,59.23 44.12,59.02 45.1,59.02 v45.2,58.92 | IC12.13 55.25,43.4 v54.72,42.87
  Bottom 0.2: 54.92,43.07 v54.72,42.87 | 55.01,43.16 v54.72,42.87 | v54.72,42.87 55.06,43.21 55.06,46.67 53.89,47.84 48.53,47.84 48.29,48.08 48.29,48.45 47.92,48.82 47.92,49.66 46.14,51.44 46.14,51.88 45.66,52.36 45.65,52.36 45.3,52.71 45.3,58.82 v45.2,58.92
D+  (via drill 0.3)
  Top 0.2: R30.1 73.99,22.37 73.79,22.57 72.63,22.57 v72.57,22.51 | R26.2 v72.37,20.34 v72.38,20.35 | v72.38,20.35 72.44,20.35 | J4.3 74.8,16.18 74.2,16.78 74.2,19.63 73.66,20.17 72.56,20.17 v72.38,20.35
  Bottom 0.2: v72.57,22.51 72.57,20.54 v72.38,20.35
D-
  Top 0.2: R25.2 71.69,21.73 72.39,21.03 72.67,21.03 73.03,20.67 73.85,20.67 74.73,19.79 74.73,17.03 76.8,14.96 J4.2
DAC1_OUT1  (via drill 0.3)
  Top 0.2: IC12.14 54.75,45.15 54.98,45.38 57.31,45.38 v57.61,45.68 | IC13.3 66.66,53.96 66.8,54.1 C51.2 66.77,54.73 66.77,55.47 67.09,55.79 v67.14,55.79
  Bottom 0.2: v67.14,55.79 67.44,55.49 67.44,52.52 68.87,51.09 68.87,48.47 66.08,45.68 v57.61,45.68
DAC2_OUT1  (via drill 0.3)
  Top 0.2: IC12.16 53.75,45.08 54.12,45.45 54.48,45.45 54.82,45.79 56.75,45.79 57.61,46.65 v57.7,46.65 57.64,46.65 | IC14.3 64.99,55.88 C52.2 65.79,55.69 v66.3,56.2
  Bottom 0.2: v66.3,56.2 66.3,55.51 67.02,54.79 67.02,52.36 68.46,50.92 68.46,48.64 65.9,46.08 58.27,46.08 v57.7,46.65
DC-IN
  Top 1.27: F1.P$1 16.19,6.61 16.19,5.92 15.44,5.17 ZD1.A 18,3.03 D3.A
DI_CH1
  Top 0.2: IC12.19 52.25,45.37 53.29,46.41 53.29,51.93 54.1,52.74 Q14.3
DI_CH2
  Top 0.2: IC12.20 51.75,45.44 52.88,46.57 52.88,50.35 51.43,51.8 46.5,51.8 45.43,50.73 45.43,50.13 Q15.3
DI_CH3
  Top 0.2: IC12.21 51.25,45.54 52.48,46.77 52.48,50.15 51.27,51.36 46.68,51.36 46.19,50.87 46.19,49.64 46,49.45 44.84,49.45 44.18,50.11 42.97,50.11 42.92,50.06 Q16.3
GND  (via drill 0.3, 0.4, 0.5, 0.6)
  Top 0.2: 45.89,46.84 v45.67,46.62 | Q14.1 56.53,53.36 56.53,52.86 56.63,52.76 57.09,52.76 57.47,52.38 57.47,51.35 56.44,50.32 54.84,50.32 v54.59,50.07 54.45,49.93 C48.2 | Q15.1 43.64,49.41 Q16.1 39.83,49.41 39.45,49.79 39.45,51.66 v39.78,51.99
  Top 0.3: 36.5,53.56 C42.2 36.39,52.49 v36.69,52.19 | C23.1 28.15,52.28 v28.13,52.3
  Top 0.4: JP11.1 42.63,54.49 41.38,53.24 41.03,53.24 v39.78,51.99
  Bottom 0.2: v54.59,50.07 54.59,47.75 55.38,46.96 55.45,46.96 55.55,46.86
  Bottom 0.3: 28.11,46.64 28.56,46.19 | v36.69,52.19 35.64,53.24 32.23,53.24 31.36,52.37 28.2,52.37 v28.13,52.3 28.11,52.28 23.55,52.28 20.73,49.46 20.73,46.89 20.79,46.83
  Bottom 0.4: v39.78,51.99 36.89,51.99 v36.69,52.19
  other vias: 10.43,40.39 86.55,21.28 54.88,33.8 66.62,43.79 31.75,44.64 60.62,44.62 24.9,45.83 57.12,44.46 48.9,44.25 69.44,32.69 69.72,38.15 66.72,39.79 62.61,23.16 57.79,22.06 59.2,27.91 55.45,29.26 52.43,31.64 51.34,32.45 60.55,22.05 8.67,33.48 12.61,44.68 15.16,37.46 23.62,34.41 19.9,31.94 34.38,30.17 45.42,31.53 8.25,27.98 49.87,41.35 26.3,43.7 31.67,43.47 33.87,42.32 30.89,46.31 28.8,46.28 37.85,46.48 33.36,46.48 32.92,44.96 32.96,43.54 82.28,32.28 71.37,38.41 73.82,34.6 11.63,41.88 62.92,32.17 69.19,28.51 82.54,20.95 81.28,20.97 49.21,26.38 46.48,29.3 46.52,28.01 46.49,30.52 50.83,31.27 55.87,42.85 55.38,40.6 25.81,28.04 20.27,22.2 20.27,24.29 70.12,45.17 86.05,38.78 77.55,41.78
  pour Bottom (rank 4): 0,70 88,70 88,62.3 71.2,62.3 71.2,45 88,45 88,0 74.2,0 74.2,9 35,9 35,0 0,0 0,47.4 18,47.4 18,63.5 0,63.5
  pour Top (rank 4): 0,70 88,70 88,62.3 71.2,62.3 71.2,45 88,45 88,0 74.2,0 74.2,9 35,9 35,0 0,0 0,47.4 18,47.4 18,63.5 0,63.5
GNDINT  (via drill 0.3, 0.6)
  Top 0.2: v77,16.09 76.15,16.8 76.14,16.81 75.62,16.81 75.55,16.88 75.55,17.54 | J4.4 72.82,14.02 72.82,15.02 v73.88,16.08 | R22.1 75.55,17.54 | 75.55,17.54 C27.2
  Top 0.3: D4.D 68.79,15.71 69.5,15 69.5,14.47 69.75,14.22
  Top 1.27: J1.1 7.44,9.01 7.89,8.56 12.52,8.56 12.58,8.5 12.6,8.5 13.75,7.35 13.75,5.68 12.79,4.72 12.79,3.64 12.18,3.03 ZD1.C
  Bottom 0.2: v73.88,16.08 v76.99,16.08 v77,16.09
  other vias: 33.66,1.86 31.89,1.52 28.4,1.8 9.1,1.8 9.1,4.4 28.18,6.53 24.35,6.92 39.56,21.15 36.67,21.32 38.25,21.85 75.8,9.7 9.1,3.1 35.4,14.81 35.43,16.13 31.77,17.68 30.19,17.17 27.06,16.25 52.7,10 39.52,26.55 5.38,16.7 8.89,16.22 5.2,18.88 74.3,10.2 63.8,10.2 60.3,10.2 67.3,10.2 56.8,10.2 39.24,27.68 22.8,8.3 22.82,10.11 28.43,17.14
  pour Bottom (rank 3): 0,19.4 33.75,19.4 38.5,24 38.5,28.7 39,29.2 42.5,29.2 43,28.7 43,24.5 44,23.5 44.5,23.5 52.6,23.6 52.6,15.7 53.9,14.4 68.7,14.4 69.1,14.5 80,14.5 81,13.5 81,0.5 80.2,0 74.5,0 74.2,0.3 74.2,8.9 74.1,9 35.1,9 35,8.9 35,0.3 34.7,0 0.3,0 0,0.3
  pour Top (rank 3): 0,19.4 33.87,19.4 38,23.5 38,28.7 38.5,29.2 42.5,29.2 43,28.7 43,25 44,24 52.6,24.1 52.6,15.7 53.9,14.4 68.7,14.4 69.1,14.5 80,14.5 81,13.5 81,0.5 80.2,0 74.5,0 74.2,0.3 74.2,8.9 74.1,9 35.1,9 35,8.9 35,0.3 34.7,0 0.3,0 0,0.3
KELVIN_M  (via drill 0.3)
  Top 0.2: IC12.27 46.72,41.75 v46.66,41.81 | D2.S 31.97,63.35 32.71,64.09 v33.46,64.09 | 31.83,62.64 D2.S | 31.67,62.8 D2.S | L4.1 31.63,62.84 D2.S
  Bottom 0.2: v46.66,41.81 46.34,42.13 46.34,42.24 46.13,42.45 46.13,43.06 46.91,43.84 46.91,47.8 43.79,50.92 42.18,50.92 39.2,53.9 39.2,58.13 38.71,58.62 36.43,58.62 33.71,61.34 33.71,63.84 v33.46,64.09
KELVIN_P  (via drill 0.3)
  Top 0.2: IC12.26 47.26,42.25 v46.8,42.71 | L5.1 v36.2,62.7 v36.19,62.71 34.08,62.71 D2.G
  Bottom 0.2: v46.8,42.71 46.8,43.16 47.31,43.67 47.31,47.97 43.96,51.32 42.35,51.32 39.6,54.07 39.6,58.3 38.87,59.03 37.2,59.03 36.19,60.04 v36.19,62.71
L1  (via drill 0.3)
  Top 0.2: IC12.42 52.25,34.87 52.42,34.7 52.42,33.84 v52.11,33.53 | v14.45,31.03 11.9,31.03 11.67,30.8 Q7.BASE | Q7.BASE 10.03,30.69 9.88,30.84 10.28,30.84 Q7.BASE
  Bottom 0.2: v14.45,31.03 14.52,31.1 21.46,31.1 21.46,31.11 23.23,32.88 29.1,32.88 30.38,34.16 31.24,34.16 32.24,35.16 48.88,35.16 49.46,34.58 49.46,34.14 50.02,33.58 52.06,33.58 v52.11,33.53
L2  (via drill 0.3)
  Top 0.2: IC12.38 50.25,34.56 v50.14,34.42 | v21.15,31.76 21.15,29.11 20.86,28.82 20.86,28.1 20.6,27.84 Q11.BASE
  Bottom 0.2: v50.14,34.42 50.14,34.83 49.77,35.2 49.41,35.2 49.05,35.56 32.02,35.56 31.05,34.59 30.21,34.59 28.92,33.3 22.69,33.3 v21.15,31.76
L3  (via drill 0.3)
  Top 0.2: IC12.36 47.32,37.25 46.37,36.3 41.94,36.3 39,33.36 v38.81,33.36 | Q6.G 34.45,24.8 v34.05,25.2
  Bottom 0.2: v34.05,25.2 34.05,26.47 35.75,28.17 36.37,28.17 36.77,28.57 36.77,31.47 38.66,33.36 v38.81,33.36
LC_PULSE
  Top 0.2: IC12.35 47.24,37.75 46.2,36.71 33.5,36.71 | 33.5,36.71 31.08,36.71 30.53,36.16 29.88,36.16 29.79,36.07 R13.2 | R15.1 34.08,35.87 34.62,35.33 R14.2 34.62,33.62 34.47,33.47 IC3.7 | 33.19,35.87 R15.1 | R15.1 33.32,36.53 33.5,36.71
LEFT
  Top 0.2: C21.2 83.79,37.49 83.22,38.06 J2.2
N$1
  Top 0.3: JP6.2 69.27,12.02 69.27,13.7 65.57,17.4 Q13.COLLECTOR
N$2  (via drill 0.3)
  Top 0.2: L6.1 9.02,37.45 v8.95,37.38
  Bottom 0.2: v8.95,37.38 4.36,37.38 JP12.3
N$3
  Top 0.2: IC6.6 24.96,13.62 R34.1 24.84,13.21 24.63,13 R35.2
N$4  (via drill 0.3)
  Top 0.2: C20.2 31.65,6.86 v31.72,6.79 | IC6.2 34.31,12.36 v34.33,12.34
  Bottom 0.2: v34.33,12.34 34.33,11.58 33.02,10.27 33.02,7.23 32.58,6.79 v31.72,6.79
N$5
  Top 0.2: IC11.6 19.43,35.72 19.15,36 18.57,36 L8.2 18.21,36.35 C43.1
N$6
  Top 0.2: IC11.7 18.8,34.45 18.55,34.19 18.55,33.56 L8.1 18.52,33.05 18.3,32.83 18.3,32.25 C41.1
N$7
  Top 0.2: R17.1 27.16,55.49 27.76,56.09 27.76,56.76 27.9,56.9 VR2.2
N$8
  Top 0.2: R31.1 C20.1
N$9
  Top 0.2: R31.2 31.64,10.13 31.96,10.45 31.96,10.96 32.06,11.06 32.62,11.06 IC6.1
  Top 0.6: IC6.1 36.2,11.09 D5.C 36.46,11.34
  Top 1.2: 36.46,11.34 41.9,11.34 42.28,10.96 L7.2
N$10
  Top 0.2: IC6.5 25.68,14.89 25.39,15.18 C15.1
N$11
  Top 0.2: C15.2 23.35,15.67 23.82,16.14 23.82,16.64 R20.2
N$12
  Top 0.2: R39.2 8.21,32.51 S1.2
N$13
  Top 0.2: R47.2 64.49,61.26 64.12,61.63 VR4.2
N$14
  Top 0.2: IC4.5 8.1,42.16 7.8,42.47 C11.1
N$15
  Top 0.2: IC4.4 8.17,42.81 7.73,43.26 7.37,43.26 7.21,43.42 C11.2
N$16
  Top 0.2: IC4.2 9.62,44.12 10.05,44.54 C10.2
N$17
  Top 0.2: VR4.1 62.97,58.74 62.09,57.86 R50.1 61.02,57.36 60.86,57.2 IC14.4
N$18  (via drill 0.3)
  Top 0.2: R54.1 68.07,63.43 68.28,63.64 71.4,63.64 71.64,63.88 D11.D 72.46,65.06 v72.9,64.62 | v64.76,58.24 64.74,58.22 63.88,58.22 63.61,57.95 R50.2 63.61,56.74 63.5,56.63 62.75,56.63 62.46,56.34 62.46,54.2 62.68,53.98 IC14.1
  Bottom 0.2: v64.76,58.24 64.76,59.7 65.91,60.85 67.01,60.85 70.75,64.59 72.87,64.59 v72.9,64.62
N$19
  Top 0.2: IC6.8 26.91,10.45 26.69,10.23 R19.2 R18.1
N$20
  Top 0.2: JP7.1 32.76,65.28 32.11,64.63 30.11,64.63 29.05,63.57 L4.2
N$21
  Top 0.2: R27.1 33.23,15.02 33.3,14.95 32.7,14.95 IC6.4
N$22
  Top 0.2: JP8.2 36.23,66.98 36.23,64.92 36.69,64.46 38.29,64.46 38.95,63.8 L5.2
N$24
  Top 0.2: IC6.7 25.75,12.36 25.45,12.06 25.45,11.12 24.87,10.54 C16.1
N$25
  Top 0.2: IC12.1 57.75,37.25 58.01,36.99 58.01,36.53 58.46,36.08 D9.D 59.18,32.53 59.52,32.19 R52.1
N$26
  Top 0.2: IC4.6 8.06,41.52 7.72,41.17 7.33,41.17 C8.2 7.25,41.09
N$27
  Top 0.2: IC4.1 8.79,44.85 8.79,45.7 C9.2
N$28
  Top 0.2: IC4.8 8.45,39.78 8.45,38.37 3,32.92 JP10.2
N$29
  Top 0.2: IC4.3 8.16,43.47 7.97,43.66 7.97,44.69 7.77,44.89 7.46,44.89 7.16,45.19 C9.1
N$30
  Top 0.2: Q12.2 35.76,55.84 35.1,56.5 IC2.1 34.03,55.44 33.81,55.22 33.31,55.22 R12.1
N$31
  Top 0.2: Q8.8 55.7,20.06 56.51,20.87 56.51,24.59 56.9,24.98 Q9.COLLECTOR
N$32
  Top 0.2: IC4.7 8.06,40.87 7.98,40.78 7.98,38.47 4.75,35.24 JP10.1
N$33  (via drill 0.3)
  Top 0.2: L3.1 18.34,46.13 18.43,46.22 v18.43,46.78
  Bottom 0.2: JP5.9 26,64.76 25.43,64.19 19.22,64.19 18.63,63.6 18.63,46.98 v18.43,46.78
N$34  (via drill 0.3)
  Top 0.2: IC12.7 58.79,40.25 v58.91,40.13 | R48.1 56.45,48.84 56.91,48.38 v56.91,47.92 | SW1.1 71,41.89 70.24,41.13 v70.24,39.45
  Bottom 0.2: v56.91,47.92 56.56,47.92 56.05,47.41 56.05,44.11 57.61,42.55 57.61,41.43 v58.91,40.13 59.97,40.13 61.15,38.95 69.74,38.95 v70.24,39.45
N$35
  Top 0.2: C56.2 64.89,43.01 Q21.3 64.91,41.98 64.53,41.6 59.94,41.6 59.68,41.34 59.68,39.77 59.37,39.46 58.64,39.46 58.35,39.75 IC12.6
N$36  (via drill 0.3)
  Top 0.2: IC4.13 13.7,42.81 13.47,43.05 12.09,43.05 v12,43.14
  Bottom 0.2: JP12.2 4.58,42.24 6.67,44.33 11.08,44.33 12,43.41 v12,43.14
N$37
  Top 0.2: IC3.5 IC3.6
N$38  (via drill 0.3)
  Top 0.2: 58.96,42.94 C54.2 58.35,42.99 58.21,42.85 58.21,41.46 58,41.25 IC12.9 56.39,41.25 55.64,42 v55.1,42 | IC12.24 | 48.64,46.76 L11.2 | IC12.24 49.75,45.15 49.57,45.33 49.57,46.05 49.93,46.41 C62.2 | 48.61,46.79 L11.2 | 48.55,47.05 L11.2 | 51.26,47.25 C61.2 | IC12.24 49.75,43.75 49.86,43.64 49.86,42.41 50.47,41.8 53.17,41.8 v53.23,41.86
  Top 0.3: 48.55,47.05 49.06,47.05 49.37,47.36 49.87,47.36 C62.2 51.27,47.42 C61.2
  Bottom 0.2: v55.1,42 53.37,42 v53.23,41.86
N$39
  Top 0.2: R14.1 36.15,34.31 37.33,34.31 38.07,33.57 38.07,30.9 37.24,30.07 35.88,30.07 35.22,29.41 35.22,28.29 35.73,27.77 IC3.3 35.73,25.73 36.23,25.24 C6.1
N$40  (via drill 0.3)
  Top 0.2: IC4.14 13.45,43.47 v13.14,43.77
  Bottom 0.2: v13.14,43.77 12.29,43.77 10.32,45.74 JP12.1
N$41
  Top 0.2: C25.2 R28.2 54.81,59.83 54.67,59.69 IC7.1 | IC7.1 | IC7.1 C26.1
N$42
  Top 0.2: C25.1 57.06,62.66 57.23,62.49 57.23,61.25 57.36,61.12 R23.2 IC7.8 58.87,59.69 59.06,59.88 59.06,60.15 59.22,60.31 C24.1
N$43
  Top 0.2: IC9.7 78.37,35.59 78.44,35.52 R32.2
N$44
  Top 0.3: IC9.1 76.6,27.26 76.45,27.11 76.45,23.06 76.97,22.54 81.51,22.54 82.46,23.49 82.46,30.3 82.9,30.74 JP15.1
N$45
  Top 0.2: R28.1 53.29,62.64 R24.2 53.27,63.33 54.22,64.28 56.61,64.28 57.25,64.92 JP13.2
N$46
  Top 0.2: R23.1 58.1,63.16 58.57,63.63 60.08,63.63 60.75,64.3 JP13.1
N$47
  Top 0.2: 57.88,56.41 R33.1 57.7,56.55 57.31,56.55 56.98,56.88 56.98,58.02 57.34,58.39 IC7.6 IC7.5
N$48
  Top 0.2: IC3.2 34.46,28.39 32.66,30.19 R11.2 30.76,30.19 30.09,30.86 30.09,31.8 R10.1 | 30.09,32.05 R10.1 | R13.1 29.79,32.99 30.11,32.67 R10.1
  Top 0.3: C4.1 28.99,31.22 29.59,31.82 R10.1
N$49  (via drill 0.3)
  Top 0.2: Q12.3 37.16,56.77 37.53,57.14 37.53,57.94 37.77,58.18 v37.77,60.36
  Bottom 0.2: 39.75,65.16 39.75,65.2 | 39.75,65.2 JP8.1 | v37.77,60.36 37.77,60.56 37.56,60.77 37.56,63.01 39.75,65.2
N$50
  Top 0.2: R36.1 50.2,63.7 51.61,65.11 53.36,65.11 53.75,65.5 JP14.1
N$51
  Top 0.2: R40.1 42.39,63.98 42.69,64.28 42.97,64.56 46.31,64.56 46.75,65 JP17.1
N$52  (via drill 0.4)
  Top 0.3: IC9.3 74.89,30.52 74.31,31.1 v74.31,32.12
  Bottom 0.3: JP15.2 75.15,34.25 74.31,33.41 v74.31,32.12
N$53  (via drill 0.5)
  Top 0.3: IC9.14 73.39,30.52 73.91,30 v73.91,29.2
  Bottom 0.3: v73.91,29.2 82.23,29.2 82.98,28.45 82.98,28.44 83.36,28.06 83.36,26.08 84.98,24.46 84.98,23.77 JP16.1
N$54
  Top 0.3: IC9.16 74.23,27.98 75.94,26.27 75.94,22.83 76.75,22.02 81.73,22.02 82.97,23.26 82.97,26.83 83.39,27.25 JP16.2
N$55
  Top 0.2: R29.2 73.6,36.35 72.84,35.59 IC9.10
N$56
  Top 0.2: IC9.8 78.3,36.87 78.41,36.98 C22.1
N$57
  Top 0.2: C22.2 80.58,39.22 84.76,43.4 J2.1
N$58
  Top 0.2: R32.1 81.65,35.52 82.27,36.14 C21.1
N$59
  Top 1.5: 82.13,8.84 F2.P$1 82.12,12.9 81.02,14 J4.1
N$60
  Top 0.2: R53.2 69.9,63.11 70.02,63.23 77.53,63.23 79.25,64.95 JP22.1
N$61
  Top 0.2: R2.1 26.07,21.9 26.3,22.13 Q1.S
N$62
  Top 0.2: C17.2 55.34,25.16 IC5.4
N$63  (via drill 0.3)
  Top 0.2: v25.22,26.95 25.22,25.83 Q2.D | R3.1 23.84,19.28 v23.72,19.4
  Bottom 0.2: v23.72,19.4 23.71,24.03 24.28,24.6 24.28,26.47 24.77,26.96 v25.21,26.96 v25.22,26.95
N$64
  Top 0.2: VR1.2 25.94,61.3 26.45,61.81 27.02,61.81 27.2,61.99 R16.1
N$65
  Top 0.2: R29.1 75.12,39.79 C19.1
N$66
  Top 0.2: Q18.COLLECTOR 21.68,47.59 22.09,48 22.09,50.26 20.43,51.92 Q17.8
N$67
  Top 0.2: Q17.4 25.63,62.9 R16.2
  Bottom 0.8: Q17.5 Q17.4
N$68
  Top 0.2: 47.95,42.8 IC12.25 47.79,42.96 C60.2 46.53,43.78 | 46.53,43.78 C59.1 | IC15.6 43.08,43.05 43.25,42.88 44.76,42.88 45.1,42.54 R55.2 45.1,41.83 45.64,41.83 45.86,42.05 45.86,43.59 46.05,43.78 46.53,43.78
N$69
  Top 0.2: L1.1 13.43,14.55 11.04,16.94 Q3.5
N$70  (via drill 0.3)
  Top 0.2: Q12.1 38.09,55.22 v38.19,55.07 | VR1.3 30.15,61.5 31.38,60.27 v31.38,59.32 31.43,59.27 IC2.4 30.59,58.4 30.31,58.12 27.52,58.12 27.18,57.78 27.18,56.11 26.82,55.75 VR2.3
  Bottom 0.2: v31.38,59.32 32.5,58.2 32.5,55.05 33.25,54.3 38,54.3 38.2,54.5 v38.19,55.07
N$71
  Top 0.2: IC13.4 R49.1 VR3.1
N$72
  Top 0.2: Q17.2 24.75,57.38 24.75,54.71 25.06,54.4 R17.2
  Bottom 0.8: Q17.7 Q17.2
N$73
  Top 0.3: Q10.4 Q10.5
N$74  (via drill 0.3)
  Top 0.2: Q10.2 13.71,22.99 14.46,23.74 17.57,23.74 C1.1 20.09,26.26 L2.2 22.55,27.15 22.98,27.58 24.18,27.58 24.49,27.89 C3.1 | C4.2 25.73,31.29 v26.17,30.85
  Bottom 0.2: C3.1 24.99,28.68 25.76,29.45 25.76,30.44 v26.17,30.85
N$75
  Top 0.2: Q1.G 28.21,23.93 27.9,24.24 27.9,24.4 Q2.G 27.59,24.85 28.37,24.85 28.6,25.08 R1.2
N$76
  Top 0.3: Q11.COLLECTOR 17.8,29.34 16.9,28.44 Q10.8
N$77
  Top 0.2: Q10.3 Q3.6 8.84,22.24 Q3.2
N$78  (via drill 0.4)
  Top 0.3: C1.2 25.02,20.68 v25.15,20.55 | v32.24,20.55 33.17,20.55 Q6.D
  Bottom 0.3: v25.15,20.55 v32.24,20.55
N$79
  Top 0.2: Q10.6 16.91,20.37 19.75,23.21 L2.1
N$80
  Top 0.2: Q7.COLLECTOR 11.77,29.3 12.44,28.63 12.44,26.84 Q3.8
N$81
  Top 0.2: 79,21.01 Q19.D 78.45,21.56 76.56,21.56 76.29,21.83 R30.2
N$82  (via drill 0.3)
  Top 0.2: 26.31,19.28 R3.2 | v18.54,19.31 18.62,19.39 22.73,19.39 23.72,18.4 26.11,18.4 26.41,18.7 R3.2 | R3.2 R4.1 27.89,19.81 27.75,19.95 27.32,19.95 27.25,20.02 Q1.D
  Bottom 0.2: v18.54,19.31 17.62,19.31 17.36,19.05 8.09,19.05 7.85,18.81 Q3.4
N$83
  Bottom 0.2: Q3.3 4.2,20.04 JP1.1
N$84  (via drill 0.3)
  Top 0.2: v69.76,53.02 69.74,53.04 IC13.1 68.56,52.1 67.54,51.08 67.54,47.37 67.26,47.09 R49.2 | D10.D 69.44,58.85 69.44,59.63 69.74,59.93 v69.76,59.93 69.9,60.07 R53.1
  Bottom 0.2: v69.76,53.02 v69.76,59.93
N$85
  Top 0.2: R46.2 61.67,49.86 VR3.2
N$86
  Top 0.5: Q8.3 Q8.6
  Top 0.8: Q8.3 60.58,13.83 JP2.2
N$87
  Top 0.2: Q21.1 60.91,39.02 C55.2 | IC12.5 58.08,39.25 58.28,39.05 60.88,39.05 C55.2 | 60.89,39.04 C55.2
N$88
  Top 0.5: Q8.2 Q8.7
  Top 0.8: Q8.2 58.38,15.13 JP2.1
N$89
  Top 0.5: Q8.4 Q8.5
  Top 0.8: Q8.4 62.78,12.53 JP2.3
N$90
  Top 0.2: JP23.1 67.75,64.72 66.55,63.52 R54.2
N$91  (via drill 0.3)
  Top 0.2: IC12.31 46.13,39.75 44.6,38.22 43.71,38.22 42.63,39.3 JP19.3 | R42.2 37.99,42.21 v37.64,42.01
  Bottom 0.2: v37.64,42.01 40.31,42.01 41.57,40.75 41.57,39.37 JP19.3
N$92
  Top 0.2: BAT1.+ 59.87,28.66 59.39,29.14 59.39,30.79 60.04,31.44 61.54,31.44 61.64,31.54 R52.2 61.64,32.74 61.42,32.96 60.32,32.96 60.14,33.14 D9.S 60.21,34.12
N$93
  Top 0.2: Q16.2 42.28,50.71 43.13,51.56 45.01,51.56 46.44,52.99 JP11.2
N$94
  Top 0.2: Q15.2 44.81,50.76 46.26,52.21 48.25,52.21 48.98,52.94 JP11.3
N$95
  Top 0.2: IC12.3 59.26,38.25 59.58,37.93 59.58,37.59 60.73,36.44 60.73,35.33 61.76,34.3 Q20.1 62.82,34.03 63.41,34.03 63.83,33.61 C46.2
N$96
  Top 0.2: IC12.4 58,38.75 58.1,38.65 59.68,38.65 60.01,38.32 60.01,37.78 60.28,37.51 Q20.4 62.78,37.73 63.43,37.73 63.98,38.28 C47.2
N$97
  Top 0.2: Q14.2 55.92,52.09 55.72,52.29 55.72,53.09 55.25,53.56 52.45,53.56 JP11.4
N$99
  Top 0.8: JP9.1 5.18,13.85 6.08,14.75 9.53,14.75 10.83,13.45 10.83,12.51 11.44,11.9 12.95,11.9 J1.3 13.56,11.29 F1.P$2
PWM1  (via drill 0.3)
  Top 0.2: v51.76,34.42 IC12.41 | Q13.BASE 67.07,26.23 66.63,26.67 63.02,26.67 v62.47,27.22
  Bottom 0.2: v62.47,27.22 62.47,29.52 58.62,33.37 58.62,35 57.99,35.63 52.97,35.63 v51.76,34.42
RANGE  (via drill 0.3)
  Top 0.2: IC12.29 33.66,40.75 32.12,42.29 25.95,42.29 v25.63,42.61 | v20.67,50.42 20.67,49.34 Q18.BASE
  Bottom 0.2: v20.67,50.42 20.27,50.02 20.27,44.75 22.5,42.52 25.54,42.52 v25.63,42.61
RELAY1
  Top 0.2: IC12.43 52.75,34.93 52.84,34.84 52.84,33.89 54.56,32.17 54.56,28.4 55.2,27.76 57.27,27.76 57.77,27.26 Q9.BASE
RIGHT
  Top 0.2: J2.3 76.23,43.4 75.14,42.31 C19.2
RXD_LA
  Top 0.2: IC4.9 | IC4.9 15.35,40.21 15.58,39.98 Q4.D | IC4.9 14.68,39.24 14.54,39.1 R5.1
RXI2  (via drill 0.3)
  Top 0.2: IC4.12 13.25,42.16 v13.1,42.34 | 51.23,35.52 IC12.40 51.25,36.26 51.78,36.79 v51.78,37.49
  Bottom 0.2: v13.1,42.34 13.23,42.18 15.32,42.18 15.6,41.9 18.65,41.9 21.77,38.78 30.62,38.78 31.72,37.68 44.65,37.68 45.57,38.6 46.58,38.6 46.79,38.39 49.28,38.39 49.54,38.65 50.62,38.65 v51.78,37.49
SCL  (via drill 0.3)
  Top 0.2: IC12.30 45.11,40.25 JP19.4 | R43.2 41.33,42.22 v41.62,41.93
  Bottom 0.2: JP19.4 44.15,39.33 44.15,39.94 43.51,40.58 42.32,40.58 41.62,41.28 v41.62,41.93
SWCLK  (via drill 0.3)
  Top 0.2: v46.08,37.53 46.05,37.57 45.67,37.57 45.21,37.11 30.79,37.11 30.25,36.57 29.36,36.57 28.59,37.34 27.77,37.34 27.49,37.62 R44.1 27.49,39.28 27.3,39.47 25.74,39.47 25.18,40.03 JP20.4 | IC12.37 49.75,37.18 v50.08,37.51
  Bottom 0.2: v46.08,37.53 46.31,37.3 49.87,37.3 v50.08,37.51
SWDIO
  Top 0.2: IC12.34 45.78,38.25 45.04,37.51 30.62,37.51 30.08,36.97 29.54,36.97 29.01,37.5 R45.1 29.01,40.53 JP20.2
TC1_ADC  (via drill 0.3)
  Top 0.2: R33.2 57.25,54.87 57.06,55.06 57.06,56.23 56.91,56.38 C35.1 54.8,56.38 R38.2 | IC12.18 52.75,45.28 53.69,46.22 53.69,50.2 54.33,50.84 55.95,50.84 v56.17,51.06 | 57.87,54.86 R33.2 | R33.2 57.86,53.68 v57.99,53.55
  Bottom 0.2: v56.17,51.06 56.17,51.73 v57.99,53.55
TXD_LA  (via drill 0.3)
  Top 0.2: R6.1 16.97,43.26 17.44,43.73 Q5.D 17.9,43.49 17.9,42.7 v17.77,42.57 | IC4.10 13.82,40.87 v13.42,40.52
  Bottom 0.2: v13.42,40.52 13.34,40.58 12.42,41.5 12.42,42.63 12.8,43.02 13.37,43.02 13.79,42.6 15.48,42.6 15.78,42.3 17.5,42.3 v17.77,42.57 17.73,42.57
TXO2  (via drill 0.3)
  Top 0.2: IC4.11 13.48,41.52 v13.43,41.46 | IC12.39 50.75,36.68 v51.02,36.96
  Bottom 0.2: v13.43,41.46 13.75,41.78 15.15,41.78 15.43,41.5 18.47,41.5 21.59,38.38 30.45,38.38 31.56,37.27 44.82,37.27 45.74,38.19 46.42,38.19 46.63,37.98 49.58,37.98 49.84,38.24 50.31,38.24 50.75,37.8 50.75,37.23 v51.02,36.96
UART_RXI
  Top 0.2: R8.1 19.71,40.69 19.48,40.92 Q4.S 18.54,41.56 19.24,42.26 19.24,45.1 19.12,45.22 19.12,50.35 18.62,50.85 18.62,63.59 19.92,64.89 21.72,64.89 22,65.17 JP5.5
UART_TXO
  Top 0.2: R9.1 21.91,44.46 21.34,44.46 21.12,44.68 Q5.S 19.59,45.43 19.59,50.47 19.03,51.03 19.03,63.43 20.08,64.48 23.7,64.48 24,64.78 JP5.7
USB_DM  (via drill 0.3)
  Top 0.2: 69.57,21.99 R25.1 | IC12.32 48.87,39.25 49.08,39.46 52.53,39.46 52.9,39.83 53.58,39.83 v54.13,39.28 | R25.1 69.14,21.73 68.52,21.11 68.12,21.11 67.68,20.67 67.68,19.97 67.84,19.81 D4.S | v69.3,26.51 69.3,25.63 68.98,25.31 68.98,22.61 69.49,22.1 R25.1
  Bottom 0.2: v69.3,26.51 69.12,26.69 68.32,26.69 65.68,29.33 63.81,29.33 59.45,33.69 59.45,35.32 55.49,39.28 v54.13,39.28
USB_DP  (via drill 0.3)
  Top 0.2: IC12.33 48.94,38.75 49.24,39.05 53.06,39.05 v53.18,39.17 | 69.54,20.48 R26.1 | R26.1 68.42,20.34 v68.36,20.4 | v68.56,25.86 68.56,22.11 v68.34,21.89 | D4.G 69.74,19.57 69.5,19.81 R26.1
  Bottom 0.2: v68.34,21.89 68.34,20.42 v68.36,20.4 | v68.56,25.86 65.49,28.93 63.64,28.93 59.04,33.53 59.04,35.15 55.57,38.62 53.73,38.62 v53.18,39.17
USB_EN  (via drill 0.3)
  Top 0.2: IC12.2 58.53,37.75 v58.69,37.59 | R22.2 R21.1 77.52,20.33 78.17,19.68 Q19.G | 75.23,20.33 R22.2 | R22.2 74.83,20.33 74.03,21.13 73.22,21.13 72.88,21.47 72.62,21.47 71.63,22.46 70.3,22.46 70,22.76 69.53,22.76 69.43,22.86 69.43,25.11 69.98,25.66 v69.98,25.86
  Bottom 0.2: v58.69,37.59 58.69,36.65 59.86,35.48 59.86,33.86 63.99,29.73 65.86,29.73 68.5,27.09 68.89,27.09 69.03,27.23 69.53,27.23 70.09,26.67 70.09,25.97 v69.98,25.86
VDD
  Top 0.2: Q4.G 20.11,39.02 R8.2 21.22,39.16 21.91,39.85 R9.2 | Q5.G 21.17,42.78 21.33,42.94 21.91,42.94 R9.2 | JP5.10 26.86,68 27.03,67.83 27.03,65 26.09,64.06 20.23,64.06 19.43,63.26 19.43,51.2 20.01,50.62 20.01,45.64 20.16,45.49 22.5,45.49 22.86,45.13 22.86,43.31 22.49,42.94 21.91,42.94 R9.2
VEE
  Top 0.2: R18.2 29.32,7.94 29.78,7.48
  Top 0.5: 25.43,3.55 22.75,3.55 21.53,4.77 L9.4
  Top 1.27: IC6.EX_PAD 29.78,7.48 29.78,5.36 28.9,4.48 | 28.9,4.48 28.78,4.5 27.66,4.5 26.71,3.55 25.43,3.55 D3.C | 28.9,4.48 C13.1
VPP  (via drill 0.4, 0.5)
  Top 0.3: v31.17,53.45 v31.16,53.44 31.16,53.17 30.91,52.92 C23.2 30.91,51.65 31.13,51.43 IC8.1 IC8.2 | IC10.1 | IC10.2 IC10.1 | IC10.1 38.02,52.3 37.91,52.41 C42.1 38.73,53.33 v39.08,52.98
  Top 0.4: v22.02,18.42 22.12,18.27 22.12,14.19 21.93,13.95 C53.1 20.79,13.25 21.03,13.01 21.36,13.01 21.53,12.84 L9.3 | IC8.2 29.02,48.97 27.08,47.03 27.08,45.84 23.35,42.11 23.35,39.31 22.73,38.69 22.73,29.6 v22.76,29.57
  Bottom 0.3: v31.17,53.45 31.56,53.84 38.22,53.84 v39.08,52.98
  Bottom 0.4: v22.02,18.42 22.02,18.91 22.05,18.94 22.05,27.55 22.69,28.19 22.69,29.5 v22.76,29.57

## Text on the board
_tplace: LATTEPANDA | MEASUREMENT | SHIELD V1.3 | D-IN | RESET | CLK | +3.3V | i2C | SWD | +3.3V | GND | SDA | SCL | + | + | DC-IN | - | DC12V~33V IN
_bplace: - | - | - | - | - | L-CUR | L-V | H-V | H-CUR | + | + | + | + | + | ADC2 | ADC1 | TC-K | DAC1 | DAC2 | 4-WIRE KELVIN | TXO | STM32 | RXI | AUDIO-IN | RS232C | GND | TXO | INTEL | SPEAKER | LEFT | RXI | + | CAN-L | - | CAN-BUS | - | RIGHT | CAN-H | LC-MEATER | + | + | - | EXT-R | DC12V~24V IN | B | C | A | +5V | DC-IN | - | - | GND | +5V | GND